# EAGLE schematic avrshift-irlml2 (EAGLE 6.6.0)
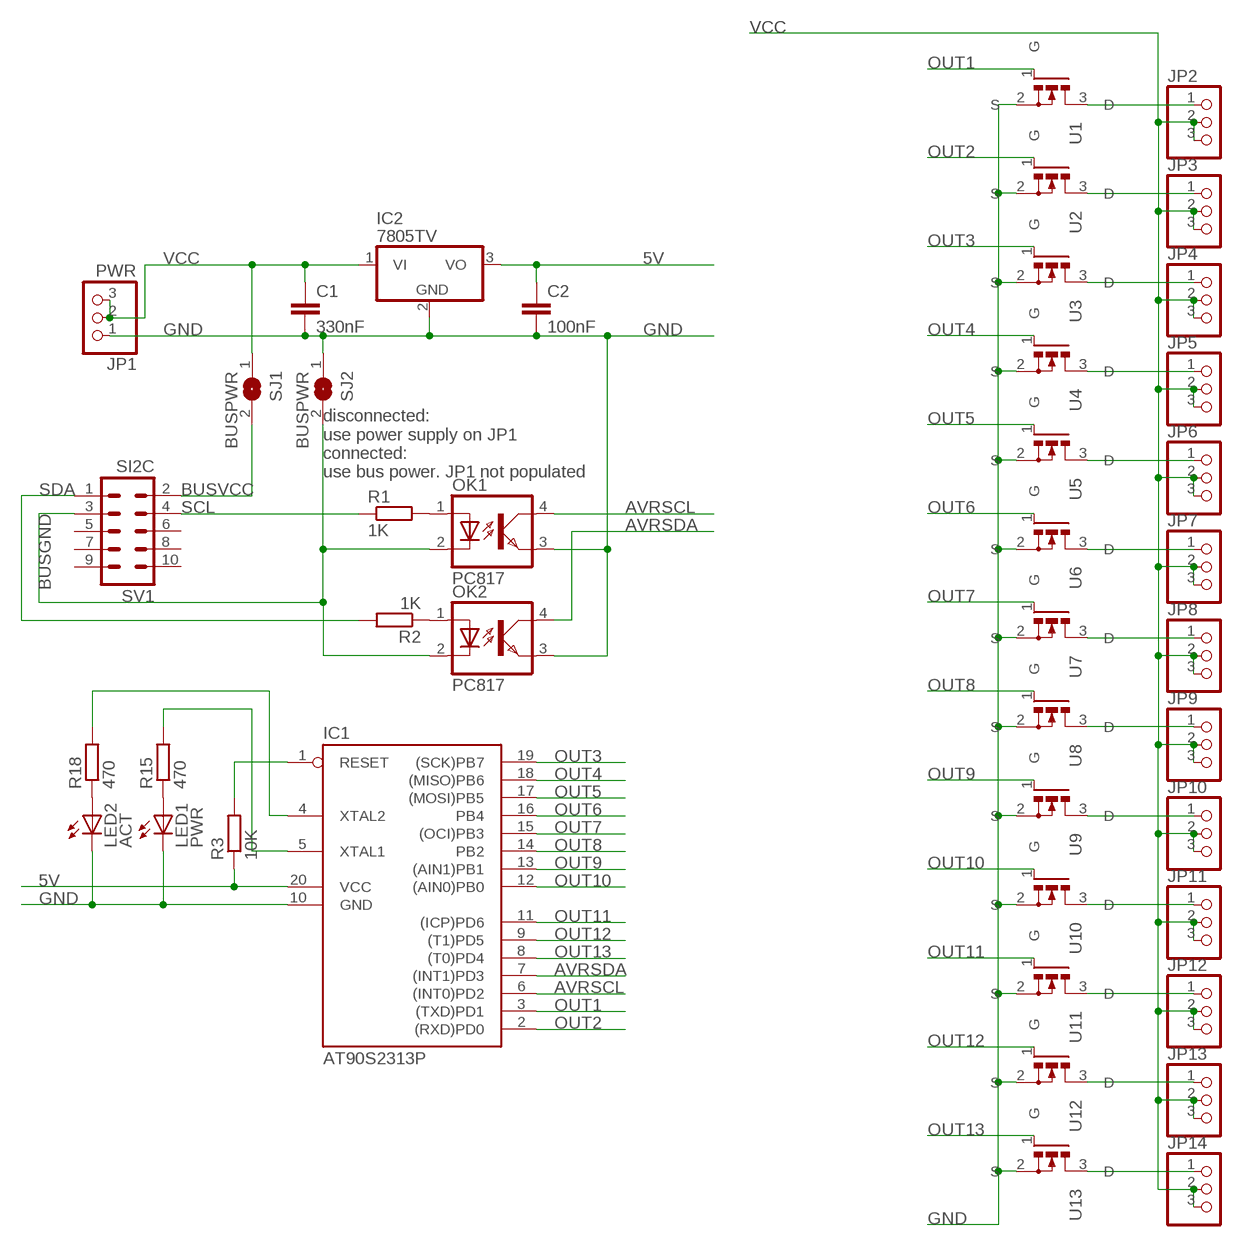
[diagram p0: schematic, sheet 1]

## Parts
C1  330nF  C-EUC0805  [C0805]
C2  100nF  C-EUC0805  [C0805]
IC1  AT90S2313P  [DIL20]
IC2  7805TV  [TO220V]
JP1  PWR  PINHD-1X3  [1X03]
JP2  PINHD-1X3  [1X03]
JP3  PINHD-1X3  [1X03]
JP4  PINHD-1X3  [1X03]
JP5  PINHD-1X3  [1X03]
JP6  PINHD-1X3  [1X03]
JP7  PINHD-1X3  [1X03]
JP8  PINHD-1X3  [1X03]
JP9  PINHD-1X3  [1X03]
JP10  PINHD-1X3  [1X03]
JP11  PINHD-1X3  [1X03]
JP12  PINHD-1X3  [1X03]
JP13  PINHD-1X3  [1X03]
JP14  PINHD-1X3  [1X03]
LED1  PWR  LED3MM  [LED3MM]
LED2  ACT  LED3MM  [LED3MM]
OK1  PC817  [DIL04]
OK2  PC817  [DIL04]
R1  1K  R-EU_0207/2V  [0207/2V]
R2  1K  R-EU_0207/2V  [0207/2V]
R3  10K  R-EU_R0805  [R0805]
R15  470  R-EU_0207/2V  [0207/2V]
R18  470  R-EU_0207/2V  [0207/2V]
SJ1  BUSPWR  SJ  [SJ]
SJ2  BUSPWR  SJ  [SJ]
SV1  SI2C  ML10  [ML10]
U1  IRFML8244TRPBF  [SOT95P240X112-3N]
U2  IRFML8244TRPBF  [SOT95P240X112-3N]
U3  IRFML8244TRPBF  [SOT95P240X112-3N]
U4  IRFML8244TRPBF  [SOT95P240X112-3N]
U5  IRFML8244TRPBF  [SOT95P240X112-3N]
U6  IRFML8244TRPBF  [SOT95P240X112-3N]
U7  IRFML8244TRPBF  [SOT95P240X112-3N]
U8  IRFML8244TRPBF  [SOT95P240X112-3N]
U9  IRFML8244TRPBF  [SOT95P240X112-3N]
U10  IRFML8244TRPBF  [SOT95P240X112-3N]
U11  IRFML8244TRPBF  [SOT95P240X112-3N]
U12  IRFML8244TRPBF  [SOT95P240X112-3N]
U13  IRFML8244TRPBF  [SOT95P240X112-3N]

## Nets
5V: C2.1 IC1.20(VCC) IC2.3(VO) R3.1
AVRSCL: IC1.6((INT0)PD2) OK1.4(COL)
AVRSDA: IC1.7((INT1)PD3) OK2.4(COL)
BUSGND: OK1.2(C) OK2.2(C) SJ2.2 SV1.3
BUSVCC: SJ1.2 SV1.2
GND: C1.2 C2.2 IC1.10(GND) IC2.2(GND) JP1.1 LED1.K(C) LED2.K(C) OK1.3(EMIT) OK2.3(EMIT) SJ2.1 U1.2(S) U2.2(S) U3.2(S) U4.2(S) U5.2(S) U6.2(S) U7.2(S) U8.2(S) U9.2(S) U10.2(S) U11.2(S) U12.2(S) U13.2(S)
N$1: OK1.1(A) R1.2
N$2: JP2.1 U1.3(D)
N$4: OK2.1(A) R2.1
N$5: JP3.1 U2.3(D)
N$6: JP4.1 U3.3(D)
N$7: JP11.1 U10.3(D)
N$8: LED2.A R18.1
N$9: JP12.1 U11.3(D)
N$10: LED1.A R15.1
N$11: JP10.1 U9.3(D)
N$12: JP9.1 U8.3(D)
N$13: JP8.1 U7.3(D)
N$14: JP7.1 U6.3(D)
N$15: JP6.1 U5.3(D)
N$17: JP13.1 U12.3(D)
N$18: JP14.1 U13.3(D)
N$21: IC1.4(XTAL2) R18.2
N$25: JP5.1 U4.3(D)
N$33: IC1.5(XTAL1) R15.2
OUT1: IC1.3((TXD)PD1) U1.1(G)
OUT2: IC1.2((RXD)PD0) U2.1(G)
OUT3: IC1.19((SCK)PB7) U3.1(G)
OUT4: IC1.18((MISO)PB6) U4.1(G)
OUT5: IC1.17((MOSI)PB5) U5.1(G)
OUT6: IC1.16(PB4) U6.1(G)
OUT7: IC1.15((OCI)PB3) U7.1(G)
OUT8: IC1.14(PB2) U8.1(G)
OUT9: IC1.13((AIN1)PB1) U9.1(G)
OUT10: IC1.12((AIN0)PB0) U10.1(G)
OUT11: IC1.11((ICP)PD6) U11.1(G)
OUT12: IC1.9((T1)PD5) U12.1(G)
OUT13: IC1.8((T0)PD4) U13.1(G)
RESET: IC1.1(RESET) R3.2
SCL: R1.1 SV1.4
SDA: R2.2 SV1.1
VCC: C1.1 IC2.1(VI) JP1.2 JP1.3 JP2.2 JP2.3 JP3.2 JP3.3 JP4.2 JP4.3 JP5.2 JP5.3 JP6.2 JP6.3 JP7.2 JP7.3 JP8.2 JP8.3 JP9.2 JP9.3 JP10.2 JP10.3 JP11.2 JP11.3 JP12.2 JP12.3 JP13.2 JP13.3 JP14.2 JP14.3 SJ1.1
Unconnected: SV1.5 SV1.6 SV1.7 SV1.8 SV1.9 SV1.10

## Notes on the sheet
- disconnected:
  use power supply on JP1
  connected:
  use bus power. JP1 not populated

## Library data of the parts
C1 C2 = rcl:C-EU: CAPACITOR, European symbol
IC1 = atmel:AT90S2313: MICROCONTROLLER 2 Kbytes FLASH 128 bytes SRAM 128 bytes EEPROM UART; OC_FARNELL: unknown; OC_NEWARK: unknown
IC2 = linear:78*: Positive VOLTAGE REGULATOR Source: http://cache.national.com/ds/LM/LM78L05.pdf http://www.fairchildsemi.com/ds/LM/LM7805.pdf
JP1-JP14 = pinhead:PINHD-1X3: PIN HEADER
LED1 LED2 = led:LED: LED OSRAM: - CHIPLED LG R971, LG N971, LY N971, LG Q971, LY Q971, LO R971, LY R971 LH N974, LH R974 LS Q976, LO Q976, LY Q976 LO Q996 - Hyper CHIPLED LW Q18S LB Q993, LB Q99A, LB R99A - SideLED LS A670, LO A670, LY A670, LG A670, LP A670 LB A673, LV A673, LT A673, LW A673 LH A674 LY A675 LS A676, LA A676, LO A676, LY A676, LW A676 LS A679, LY A679, LG A679 - Hyper Micro SIDELED® LS Y876, LA Y876, LO Y876, LY Y876 LT Y87S - SmartLED LW L88C, LW L88S LB L89C, LB L89S, LG L890 LS L89K, LO L89K, LY L89K LS L896, LA L896, LO L896, LY L896 - TOPLED LS T670, LO T670, LY T670, LG T670, LP T670 LSG T670, LSP T670, LSY T670, LOP T670, LYG T670 LG T671, LOG T671, LSG T671 LB T673, LV T673, LT T673, LW T673 LH T674 LS T676, LA T676, LO T676, LY T676, LB T676, LH T676, LSB T676, LW T676 LB T67C, LV T67C, LT T67C, LS T67K, LO T67K, LY T67K, LW E67C LS E67B, LA E67B, LO E67B, LY E67B, LB E67C, LV E67C, LT E67C LW T67C LS T679, LY T679, LG T679 LS T770, LO T770, LY T770, LG T770, LP T770 LB T773, LV T773, LT T773, LW T773 LH T774 LS E675, LA E675, LY E675, LS T675 LS T776, LA T776, LO T776, LY T776, LB T776 LHGB T686 LT T68C, LB T68C - Hyper Mini TOPLED® LB M676 - Mini TOPLED Santana® LG M470 LS M47K, LO M47K, LY M47K Source: http://www.osram.convergy.de LUXEON: - LUMILED® LXK2-PW12-R00, LXK2-PW12-S00, LXK2-PW14-U00, LXK2-PW14-V00 LXK2-PM12-R00, LXK2-PM12-S00, LXK2-PM14-U00 LXK2-PE12-Q00, LXK2-PE12-R00, LXK2-PE12-S00, LXK2-PE14-T00, LXK2-PE14-U00 LXK2-PB12-K00, LXK2-PB12-L00, LXK2-PB12-M00, LXK2-PB14-N00, LXK2-PB14-P00, LXK2-PB14-Q00 LXK2-PR12-L00, LXK2-PR12-M00, LXK2-PR14-Q00, LXK2-PR14-R00 LXK2-PD12-Q00, LXK2-PD12-R00, LXK2-PD12-S00 LXK2-PH12-R00, LXK2-PH12-S00 LXK2-PL12-P00, LXK2-PL12-Q00, LXK2-PL12-R00 Source: www.luxeon.com KINGBRIGHT: KA-3528ASYC Source: www.kingbright.com
OK1 OK2 = optocoupler:PC817: SHARP OPTO COUPLER; MPN: PC817X4J000F; OC_FARNELL: 9707727; OC_NEWARK: 97K7059
R1-R3 R15 R18 = rcl:R-EU_: RESISTOR, European symbol
SJ1 SJ2 = jumper:SJ: SMD solder JUMPER
SV1 = con-harting-ml:ML10: HARTING; OC_FARNELL: unknown; OC_NEWARK: unknown
U1-U13 = IRFML8244TRPBF:IRFML8244TRPBF: Power MOSFET; MPN: IRFML8244TRPBF; OC_FARNELL: 1857298; OC_NEWARK: 25T5496; PACKAGE: SOT-23-3; SUPPLIER: INTERNATIONAL RECTIFIER

## Net classes
0 default: clearance 0.205 mm